# Altium project RK3568_train.PrjPcb (part 6 of 6)

## Sheet WIFI.schdoc: =
size A4; Symbol: Sheet-Symbol_A4; Company: 嘉立创EDA; Version: V1.0; Page Size: A4; @Project Name: RK3568B2地瓜派; @Page Count: 27; @Update Date: 2025-09-15; @Create Date: 2025-09-11; @Schematic Name: Schematic1; @Page No: 23; @Page Name: WIFI; Device: Sheet-Symbol_A4; Border: 1; Title Block Position: 3; Width: 1170; Height: 825; Region Start: 1; X Region Count: 6; Y Region Count: 4; Blade Width: 10; @Board Name: Board1; @Create Time: 22:26:48; @Update Time: 13:26:38; Organization: ORGANIZATION; Address1: ADDRESS 1; Address2: ADDRESS 2; Address3: ADDRESS 3; Address4: ADDRESS 4; Revision: V1.0.0; SheetNumber: 28; SheetTotal: 28
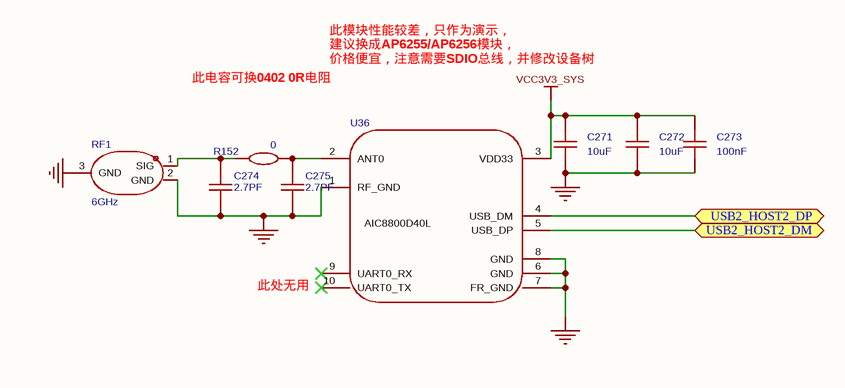
[diagram p27: WIFI.schdoc]

### Parts
C271  10uF  [C0603]
C272  10uF  [C0603]
C273  100nF  [C0603]
C274  2.7PF  [MYC0402]
C275  2.7PF  [MYC0402]
R152  0  [R0402]
RF1  6GHz  [IPEX-SMD_BWIPX-1-001E]
U36  (no value)  [BL_M8800DU6_40L]

### Ports
USB2_HOST2_DM (bidir), USB2_HOST2_DP (bidir)

### Nets
GND: C271.1 C272.1 C273.1 C274.1 C275.1 RF1.2(GND) RF1.3(GND) U36.1(RF_GND) U36.6(GND) U36.7(FR_GND) U36.8(GND)
VCC3V3_SYS: C271.2 C272.2 C273.2 U36.3(VDD33)
USB2_HOST2_DM: U36.5(USB_DP) ; port USB2_HOST2_DM
USB2_HOST2_DP: U36.4(USB_DM) ; port USB2_HOST2_DP
NetC274_2: C274.2 R152.1 RF1.1(SIG)
NetC275_2: C275.2 R152.2 U36.2(ANT0)

Not connected (* = marked no-connect by the designer): U36 9(UART0_RX)* 10(UART0_TX)*

### Notes on the sheet
- 此电容可换0402 0R电阻
- (near U36) 此模块性能较差，只作为演示，
  建议换成AP6255/AP6256模块，
  价格便宜，注意需要SDIO总线，并修改设备树
- 此处无用
- Drawn By :
- Checked By :
- Approved By :
- SheetNumber
- SheetTotal
- Revision :
- Time :
- Size :
- Date :
- A4
- DocumentName :
- Project :
- (in symbol BL_M8800DU6_40L) AIC8800D40L

### Library data of the parts
C271 C272 = CAP_0603: Symbol: Capacitance; ConvertToPcb: yes; ModelId: ac125912035d415993ca9572d50418b1聨0819f05c4eef4c71ace90d822a990e87; ModelName: C0603_L1.6-W0.8-H0.8; ModelTransform: 62.992,31.496,0,0,0,0,0,0,0; Device: CAP_0603; Value: 10uF; AddInBom: yes; Supplier Footprint: 0603; FootprintName: C0603
C273 = CAP_0603: Symbol: Capacitance; Value: 10uF; ConvertToPcb: yes; ModelId: ac125912035d415993ca9572d50418b1聨0819f05c4eef4c71ace90d822a990e87; ModelName: C0603_L1.6-W0.8-H0.8; ModelTransform: 62.992,31.496,0,0,0,0,0,0,0; Device: CAP_0603; AddInBom: yes; Supplier Footprint: 0603; FootprintName: C0603
C274 C275 = CAP_0402: Symbol: Capacitance; ConvertToPcb: yes; ModelId: 36a51122f27c49738f86b3bfa98863e0; ModelName: C0402_L1.0-W0.5-H0.5; ModelTransform: 39.37,19.685,0,0,0,0,0,0,0; Value: 2.7PF; Device: CAP_0402; AddInBom: yes; Supplier Footprint: 0402; FootprintName: MYC0402
R152 = Res_0402: as R130-R133 on sheet EMMC; Value: 0; Device: Res_0402; AddInBom: yes; Supplier Footprint: 0402; FootprintName: R0402
RF1 = BWIPX-1-001E: 连接器类型:板端;接口类型:内针;端口数量:1;接口直径:-;接口长度/高度:-;频率:6GHz;射频系列:IPEX;阻抗:50Ω;样式:-;工作温度:-;; Manufacturer: BAT WIRELESS(蝙蝠无线); AddInBom: yes; ModelId: e9910d1cc3f644ef905f39c3184653d7; ModelTransform: 122.047,118.11,0,180,0,0,29.921,0,0; Connector Type: 板端; Interface: 内针; Number of Ports: 1; RF Series: IPEX; Impedance: 50Ω; Symbol: BWIPX-1-001E; Device: BWIPX-1-001E; LCSC Part Name: IPEX 内针; SupplierPart: C496552; ManufacturerPart: BWIPX-1-001E; Supplier Footprint: SMD; JLCPCB Part Class: 扩展库; Datasheet: https://item.szlcsc.com/datasheet/BWIPX-1-001E/508501.html; Supplier: LCSC; ConvertToPcb: yes; FootprintName: IPEX-SMD_BWIPX-1-001E; ModelName: IPEX-SMD_BWIPX-1-001E; Interface Diameter: -; Interface Length/Height: -; Value: 6GHz; Style: -; Operating Temperature Range: -
U36 = BL_M8800DU6_40L: AIC8800D40L双频5G无线模块wifi6+BLE蓝牙配网IPC摄像头投屏图传; AddInBom: yes; Device: BL_M8800DU6_40L; ConvertToPcb: yes; SymbolName: BL_M8800DU6_40L; FootprintName: BL_M8800DU6_40L

## Nets that join several sheets
GND: DCDC (43 pins), RK809-5 (58 pins), SOC_PWR (226 pins), SOC_LOGIC (20 pins), SOC_CAM (C122.1 C123.1), SOC_COMPHY_USB (16 pins), SOC_DDR (11 pins), SOC_DISPLAY (11 pins), SOC_FLASH (C155.1 C156.1 GND1.1), SOC_IO (C157.1 C158.1), SOC_MAC_SAR_I2S (6 pins), SOC_SOUND (C164.1), USB (33 pins), PCIE (11 pins), RGMII (35 pins), SD (14 pins), HDMI (14 pins), LPDDR4_4X (103 pins), EMMC (22 pins), AUDIO (10 pins), KEY_LED (26 pins), CAM (7 pins), DISPLAY (21 pins), WIFI (11 pins)
LCD_1V8: DCDC (R5.1), RK809-5 (5 pins), SOC_IO (5 pins), SOC_MAC_SAR_I2S (C163.2 U7.H20), RGMII (R101.1), DISPLAY (FPC4.29)
MIPI_AVDD_0V9: RK809-5 (L13.2), SOC_CAM (C122.2 U7.W14), SOC_DISPLAY (C153.2 U7.W16)
MIPI_AVDD_1V8: RK809-5 (L15.2), SOC_CAM (C123.2 U7.Y14), SOC_DISPLAY (C154.2 U7.Y17)
TP_3V3: RK809-5 (C58.1 R20.1 U6.55), SOC_COMPHY_USB (C125.2 C128.2 U7.M23 U7.P10), SOC_IO (C158.2 R55.2 U7.V10 U7.V11), SOC_MAC_SAR_I2S (C159.2 U7.V12), RGMII (R103.1), HDMI (5 pins), EMMC (8 pins), DISPLAY (C267.2 FPC3.1)
USB_AVDD_0V9: RK809-5 (L10.2), SOC_COMPHY_USB (C127.2 C130.2 U7.P22 U7.R8)
USB_AVDD_1V8: RK809-5 (L12.2), SOC_COMPHY_USB (C126.2 C129.2 U7.P9 U7.P23)
VBUS12V: DCDC (6 pins), DISPLAY (C268.2 L20.2 U35.6)
VCC0V6_DDR: DCDC (6 pins), SOC_DDR (11 pins), LPDDR4_4X (40 pins)
VCC1V8_DDR: DCDC (R8.2), LPDDR4_4X (16 pins)
VCC3V3_PMU: DCDC (R3.2 R4.2), RK809-5 (C45.1 R30.1 U6.31), SOC_LOGIC (8 pins)
VCC3V3_SD: RK809-5 (C52.1 U6.58), SD (C203.2 C204.1 CARD1.4)
VCC3V3_SYS: DCDC (7 pins), RK809-5 (17 pins), RGMII (R106.1), KEY_LED (8 pins), CAM (L19.1), DISPLAY (L21.1), WIFI (C271.2 C272.2 C273.2 U36.3)
VCC5V0_SYS: DCDC (14 pins), RK809-5 (L11.1 R25.2 R26.2), USB (6 pins), PCIE (6 pins), HDMI (D8.2)
VCC_DDR: DCDC (R15.1), RK809-5 (5 pins), SOC_DDR (14 pins), LPDDR4_4X (44 pins)
VCCA1V8_IMAGE: RK809-5 (C50.1 C73.2 L15.1 U6.6), SOC_DISPLAY (C152.2 U7.W18)
VCCA1V8_PMU: RK809-5 (C48.1 U6.5), SOC_LOGIC (C113.2 C114.2 U7.Y21), LPDDR4_4X (R127.2)
VCCA_1V8: RK809-5 (C46.1 C66.2 L12.1 U6.3), SOC_LOGIC (C118.2 C119.2 U7.N10), SOC_COMPHY_USB (6 pins), SOC_MAC_SAR_I2S (C162.2 R64.1 U7.H22)
VCCIO_ACODEC: RK809-5 (C37.1 U6.28), SOC_SOUND (C164.2 R65.2 R66.2 U7.H17), AUDIO (R138.2)
VCCIO_FLASH: DCDC (C13.2 R5.2), SOC_FLASH (C156.2 U7.H18), EMMC (12 pins)
VCCIO_SD: RK809-5 (C44.1 U6.29), SOC_FLASH (C155.2 U7.L22)
VCCIO_WL: RK809-5 (C60.2 R18.2 R20.2 R27.1), SOC_MAC_SAR_I2S (C160.2 U7.J21)
VDD_CPU: DCDC (7 pins), SOC_PWR (15 pins)
VDD_GPU: RK809-5 (8 pins), SOC_PWR (10 pins)
VDD_LOGIC: RK809-5 (8 pins), SOC_PWR (17 pins)
VDD_NPU: RK809-5 (8 pins), SOC_PWR (9 pins)
VDDA0V9_IMAGE: RK809-5 (C30.1 C69.2 L13.1 U6.23), SOC_DISPLAY (C150.2 C151.2 U7.V17 U7.V18)
VDDA0V9_PMU: RK809-5 (C35.1 U6.20), SOC_LOGIC (6 pins)
VDDA_0V9: RK809-5 (C34.1 C64.2 L10.1 U6.21), SOC_LOGIC (C115.2 C116.2 U7.P11), SOC_COMPHY_USB (8 pins)
CAM0_CKN: SOC_CAM (U7.AH10), CAM (U34.8)
CAM0_CKP: SOC_CAM (U7.AG10), CAM (U34.9)
CAM0_DN0: SOC_CAM (U7.AH12), CAM (U34.2)
CAM0_DN1: SOC_CAM (U7.AH11), CAM (U34.5)
CAM0_DP0: SOC_CAM (U7.AG12), CAM (U34.3)
CAM0_DP1: SOC_CAM (U7.AG11), CAM (U34.7)
CAM0_GPIO: SOC_IO (U7.AA1), CAM (U34.11)
CAM_SCL: SOC_IO (R54.1 U7.V5), CAM (U34.13)
CAM_SDA: SOC_IO (R53.1 U7.V6), CAM (U34.14)
CHG_INT_L_GPIO0_C2: SOC_LOGIC (U7.AG23), KEY_LED (Q4.5)
DDR_A0_A: SOC_DDR (U7.C2), LPDDR4_4X (U21.H2)
DDR_A0_B: SOC_DDR (U7.B8), LPDDR4_4X (U21.R2)
DDR_A1_A: SOC_DDR (U7.B1), LPDDR4_4X (U21.J2)
DDR_A1_B: SOC_DDR (U7.A7), LPDDR4_4X (U21.P2)
DDR_A2_A: SOC_DDR (U7.E4), LPDDR4_4X (U21.H9)
DDR_A2_B: SOC_DDR (U7.E11), LPDDR4_4X (U21.R9)
DDR_A3_A: SOC_DDR (U7.C4), LPDDR4_4X (U21.H10)
DDR_A3_B: SOC_DDR (U7.D9), LPDDR4_4X (U21.R10)
DDR_A4_A: SOC_DDR (U7.C5), LPDDR4_4X (U21.H11)
DDR_A4_B: SOC_DDR (U7.E9), LPDDR4_4X (U21.R11)
DDR_A5_A: SOC_DDR (U7.D5), LPDDR4_4X (U21.J11)
DDR_A5_B: SOC_DDR (U7.B7), LPDDR4_4X (U21.P11)
DDR_A_CKE0: SOC_DDR (U7.B3), LPDDR4_4X (U21.J4)
DDR_A_CKE1: SOC_DDR (U7.F4), LPDDR4_4X (U21.J5)
DDR_A_CLKN: SOC_DDR (U7.A4), LPDDR4_4X (U21.J9)
DDR_A_CLKP: SOC_DDR (U7.B4), LPDDR4_4X (U21.J8)
DDR_A_CS0: SOC_DDR (U7.A2), LPDDR4_4X (U21.H4)
DDR_A_CS1: SOC_DDR (U7.B2), LPDDR4_4X (U21.H3)
DDR_A_DQS0N: SOC_DDR (U7.G2), LPDDR4_4X (U21.E3)
DDR_A_DQS0P: SOC_DDR (U7.G1), LPDDR4_4X (U21.D3)
DDR_A_DQS1N: SOC_DDR (U7.L1), LPDDR4_4X (U21.E10)
DDR_A_DQS1P: SOC_DDR (U7.L2), LPDDR4_4X (U21.D10)
DDR_A_ODTCA: SOC_DDR (U7.C1), LPDDR4_4X (U21.G2)
DDR_B_CKE0: SOC_DDR (U7.D6), LPDDR4_4X (U21.P4)
DDR_B_CKE1: SOC_DDR (U7.E6), LPDDR4_4X (U21.P5)
DDR_B_CLKN: SOC_DDR (U7.A5), LPDDR4_4X (U21.P9)
DDR_B_CLKP: SOC_DDR (U7.B6), LPDDR4_4X (U21.P8)
DDR_B_CS0: SOC_DDR (U7.D8), LPDDR4_4X (U21.R4)
DDR_B_CS1: SOC_DDR (U7.E8), LPDDR4_4X (U21.R3)
DDR_B_DQS0N: SOC_DDR (U7.B11), LPDDR4_4X (U21.V3)
DDR_B_DQS0P: SOC_DDR (U7.A11), LPDDR4_4X (U21.W3)
DDR_B_DQS1N: SOC_DDR (U7.A15), LPDDR4_4X (U21.V10)
DDR_B_DQS1P: SOC_DDR (U7.B15), LPDDR4_4X (U21.W10)
DDR_B_ODTCA: SOC_DDR (U7.A8), LPDDR4_4X (U21.T2)
DDR_DM0_A: SOC_DDR (U7.H5), LPDDR4_4X (U21.C3)
DDR_DM0_B: SOC_DDR (U7.D14), LPDDR4_4X (U21.Y3)
DDR_DM1_A: SOC_DDR (U7.J4), LPDDR4_4X (U21.C10)
DDR_DM1_B: SOC_DDR (U7.E17), LPDDR4_4X (U21.Y10)
DDR_DQ0_A: SOC_DDR (U7.F2), LPDDR4_4X (U21.B2)
DDR_DQ0_B: SOC_DDR (U7.B10), LPDDR4_4X (U21.AA2)
DDR_DQ1_A: SOC_DDR (U7.E1), LPDDR4_4X (U21.C2)
DDR_DQ1_B: SOC_DDR (U7.A9), LPDDR4_4X (U21.Y2)
DDR_DQ2_A: SOC_DDR (U7.E2), LPDDR4_4X (U21.E2)
DDR_DQ2_B: SOC_DDR (U7.D12), LPDDR4_4X (U21.V2)
DDR_DQ3_A: SOC_DDR (U7.D1), LPDDR4_4X (U21.F2)
DDR_DQ3_B: SOC_DDR (U7.E12), LPDDR4_4X (U21.U2)
DDR_DQ4_A: SOC_DDR (U7.J1), LPDDR4_4X (U21.F4)
DDR_DQ4_B: SOC_DDR (U7.A12), LPDDR4_4X (U21.U4)
DDR_DQ5_A: SOC_DDR (U7.J2), LPDDR4_4X (U21.E4)
DDR_DQ5_B: SOC_DDR (U7.D15), LPDDR4_4X (U21.V4)
DDR_DQ6_A: SOC_DDR (U7.H1), LPDDR4_4X (U21.C4)
DDR_DQ6_B: SOC_DDR (U7.E15), LPDDR4_4X (U21.Y4)
DDR_DQ7_A: SOC_DDR (U7.H4), LPDDR4_4X (U21.B4)
DDR_DQ7_B: SOC_DDR (U7.E14), LPDDR4_4X (U21.AA4)
DDR_DQ8_A: SOC_DDR (U7.M1), LPDDR4_4X (U21.B11)
DDR_DQ8_B: SOC_DDR (U7.A16), LPDDR4_4X (U21.AA11)
DDR_DQ9_A: SOC_DDR (U7.N2), LPDDR4_4X (U21.C11)
DDR_DQ9_B: SOC_DDR (U7.B17), LPDDR4_4X (U21.Y11)
DDR_DQ10_A: SOC_DDR (U7.L7), LPDDR4_4X (U21.E11)
DDR_DQ10_B: SOC_DDR (U7.A17), LPDDR4_4X (U21.V11)
DDR_DQ11_A: SOC_DDR (U7.L6), LPDDR4_4X (U21.F11)
DDR_DQ11_B: SOC_DDR (U7.B18), LPDDR4_4X (U21.U11)
DDR_DQ12_A: SOC_DDR (U7.K2), LPDDR4_4X (U21.F9)
DDR_DQ12_B: SOC_DDR (U7.B13), LPDDR4_4X (U21.U9)
DDR_DQ13_A: SOC_DDR (U7.J6), LPDDR4_4X (U21.E9)
DDR_DQ13_B: SOC_DDR (U7.A13), LPDDR4_4X (U21.V9)
DDR_DQ14_A: SOC_DDR (U7.J7), LPDDR4_4X (U21.C9)
DDR_DQ14_B: SOC_DDR (U7.D17), LPDDR4_4X (U21.Y9)
DDR_DQ15_A: SOC_DDR (U7.L4), LPDDR4_4X (U21.B9)
DDR_DQ15_B: SOC_DDR (U7.B14), LPDDR4_4X (U21.AA9)
DDR_RESET: SOC_DDR (U7.F11), LPDDR4_4X (U21.T11)
EMMC_CLKOUT/FLASH_DQS: SOC_FLASH (R51.2), EMMC (U22.M6)
EMMC_CMD/FLASH_WRN: SOC_FLASH (U7.B22), EMMC (R131.2 U22.M5)
EMMC_D0/FLASH_D0: SOC_FLASH (R50.1 U7.A24), EMMC (R130.1 U22.A3)
EMMC_D1/FLASH_D1: SOC_FLASH (U7.C21), EMMC (U22.A4)
EMMC_D2/FLASH_D2: SOC_FLASH (U7.B24), EMMC (U22.A5)
EMMC_D3/FLASH_D3: SOC_FLASH (U7.D21), EMMC (U22.B2)
EMMC_D4/FLASH_D4: SOC_FLASH (U7.A25), EMMC (U22.B3)
EMMC_D5/FLASH_D5: SOC_FLASH (U7.E21), EMMC (U22.B4)
EMMC_D6/FLASH_D6: SOC_FLASH (U7.E22), EMMC (U22.B5)
EMMC_D7/FLASH_D7: SOC_FLASH (U7.B25), EMMC (U22.B6)
EMMC_DATA_STROBE/FLASH_CLE: SOC_FLASH (U7.A26), EMMC (R132.2 U22.H5)
EMMC_RSTN/FSPI_D2/FLASH_WPN: SOC_FLASH (U7.F20), EMMC (C260.2 R133.2 U22.K5)
FLASH_VOL_SEL: DCDC (R4.1), SOC_LOGIC (U7.AG25)
GAMC1_MDIO_M0: SOC_IO (U7.AC2), PCIE (FPC1.24)
GMAC0_INT/PMEB_GPIO3_C0: SOC_IO (R55.1 U7.AD2), RGMII (U13.31)
GMAC0_MCLKINOUT: SOC_MAC_SAR_I2S (U7.F25), RGMII (C187.1 R88.1 R89.2)
GMAC0_MDC: SOC_MAC_SAR_I2S (R63.2), RGMII (U13.13)
GMAC0_MDIO: SOC_MAC_SAR_I2S (U7.H23), RGMII (R102.2 U13.14)
GMAC0_RSTN_GPIO3_B7: SOC_IO (U7.AD4), RGMII (R105.1)
GMAC0_RXCLK: SOC_MAC_SAR_I2S (U7.B28), RGMII (R111.2)
GMAC0_RXD0: SOC_MAC_SAR_I2S (U7.F27), RGMII (R107.2)
GMAC0_RXD1: SOC_MAC_SAR_I2S (U7.H25), RGMII (R108.2)
GMAC0_RXD2: SOC_MAC_SAR_I2S (U7.E27), RGMII (R109.2)
GMAC0_RXD3: SOC_MAC_SAR_I2S (U7.E28), RGMII (R110.2)
GMAC0_RXDV_CRS: SOC_MAC_SAR_I2S (U7.F24), RGMII (R112.2)
GMAC0_TXCLK: SOC_MAC_SAR_I2S (R58.2), RGMII (U13.20)
GMAC0_TXD0: SOC_MAC_SAR_I2S (R59.2), RGMII (U13.18)
GMAC0_TXD1: SOC_MAC_SAR_I2S (R60.2), RGMII (U13.17)
GMAC0_TXD2: SOC_MAC_SAR_I2S (R56.2), RGMII (U13.16)
GMAC0_TXD3: SOC_MAC_SAR_I2S (R57.2), RGMII (U13.15)
GMAC0_TXEN: SOC_MAC_SAR_I2S (R61.2 R62.1), RGMII (U13.19)
GMAC1_INT/PMEB_GPIO3_A7: SOC_IO (U7.AH2), PCIE (FPC1.21)
GMAC1_MDC_M0: SOC_IO (U7.AC3), PCIE (FPC1.23)
GMAC1_RSTN_GPIO3_B0: SOC_IO (U7.AG2), PCIE (FPC1.22)
HDMI_TX0N_PORT: SOC_DISPLAY (R46.2), HDMI (D5.2 D5.9 HDMI1.9)
HDMI_TX0P_PORT: SOC_DISPLAY (R45.2), HDMI (D5.1 D5.10 HDMI1.7)
HDMI_TX1N_PORT: SOC_DISPLAY (R44.2), HDMI (D4.5 D4.6 HDMI1.6)
HDMI_TX1P_PORT: SOC_DISPLAY (R43.2), HDMI (D4.4 D4.7 HDMI1.4)
HDMI_TX2N_PORT: SOC_DISPLAY (R42.2), HDMI (D4.2 D4.9 HDMI1.3)
HDMI_TX2P_PORT: SOC_DISPLAY (R41.2), HDMI (D4.1 D4.10 HDMI1.1)
HDMI_TX_HPDIN: SOC_DISPLAY (C149.2 U7.AB18), HDMI (R120.1)
HDMI_TXCLKN_PORT: SOC_DISPLAY (R48.2), HDMI (D5.5 D5.6 HDMI1.12)
HDMI_TXCLKP_PORT: SOC_DISPLAY (R47.2), HDMI (D5.4 D5.7 HDMI1.10)
HDMITX_CEC_M0: SOC_MAC_SAR_I2S (U7.AH6), HDMI (Q3.2 R126.1)
HDMITX_SCL: SOC_MAC_SAR_I2S (U7.AG8), HDMI (Q1.2 R122.1)
HDMITX_SDA: SOC_MAC_SAR_I2S (U7.AG7), HDMI (Q2.2 R124.1)
HP_L: RK809-5 (U6.39), AUDIO (R136.1)
HP_R: RK809-5 (U6.41), AUDIO (R137.1)
HP_SNS: RK809-5 (U6.40), AUDIO (R134.1 R135.1)
I2C0_SCL_PMIC: DCDC (U1.A3), RK809-5 (U6.1), SOC_LOGIC (R35.1 U7.AF24)
I2C0_SDA_PMIC: DCDC (U1.B1), RK809-5 (U6.2), SOC_LOGIC (R36.1 U7.AB21)
I2C1_SCL_TP: SOC_LOGIC (R37.1 U7.AG24), DISPLAY (FPC3.3)
I2C1_SDA_TP: SOC_LOGIC (R38.1 U7.AB20), DISPLAY (FPC3.2)
I2C3_SCL_M0: SOC_SOUND (R66.1 U7.E18), KEY_LED (FPC2.4)
I2C3_SDA_M0: SOC_SOUND (R65.1 U7.D18), KEY_LED (FPC2.3)
I2S1_LRCK_TX_M0_RK809: RK809-5 (U6.14), SOC_SOUND (U7.A20)
I2S1_MCLK_M0_RK809: RK809-5 (U6.16), SOC_SOUND (U7.A19)
I2S1_SCLK_TX_M0_RK809: RK809-5 (U6.15), SOC_SOUND (U7.B19)
I2S1_SDI0_M0/PDM_SDI0_M0_RK809: RK809-5 (U6.18), SOC_SOUND (U7.B21)
I2S1_SDO0_M0_RK809: RK809-5 (U6.17), SOC_SOUND (U7.B20)
LCD0_BL_PWM4: SOC_LOGIC (U7.AE23), DISPLAY (R151.2 U35.4)
LCD_CKN: SOC_DISPLAY (U7.AG15), DISPLAY (FPC4.18)
LCD_CKP: SOC_DISPLAY (U7.AH15), DISPLAY (FPC4.17)
LCD_D0N: SOC_DISPLAY (U7.AG17), DISPLAY (FPC4.21)
LCD_D0P: SOC_DISPLAY (U7.AH17), DISPLAY (FPC4.20)
LCD_D1N: SOC_DISPLAY (U7.AG16), DISPLAY (FPC4.15)
LCD_D1P: SOC_DISPLAY (U7.AH16), DISPLAY (FPC4.14)
LCD_D2N: SOC_DISPLAY (U7.AG14), DISPLAY (FPC4.12)
LCD_D2P: SOC_DISPLAY (U7.AH14), DISPLAY (FPC4.11)
LCD_D3N: SOC_DISPLAY (U7.AG13), DISPLAY (FPC4.24)
LCD_D3P: SOC_DISPLAY (U7.AH13), DISPLAY (FPC4.23)
LCD_RST: SOC_IO (U7.AA6), DISPLAY (FPC4.27)
MIC1_INN: RK809-5 (C84.2), AUDIO (C262.1 MIC1.2 R140.2)
MIC1_INP: RK809-5 (C79.2), AUDIO (C262.2 MIC1.1 R139.1)
PCIE20_CLKREQN_M1: SOC_IO (U7.AG6), PCIE (FPC1.9)
PCIE20_PERSTN_M1: SOC_IO (U7.AD1), PCIE (FPC1.8)
PCIE20_REFCLKN: SOC_COMPHY_USB (U7.V25), PCIE (C178.1)
PCIE20_REFCLKP: SOC_COMPHY_USB (U7.V24), PCIE (C177.1)
PCIE20_RXN: SOC_COMPHY_USB (U7.Y28), PCIE (C181.1)
PCIE20_RXP: SOC_COMPHY_USB (U7.Y27), PCIE (C182.1)
PCIE20_TXN: SOC_COMPHY_USB (U7.W28), PCIE (C179.1)
PCIE20_TXP: SOC_COMPHY_USB (U7.W27), PCIE (C180.1)
PCIE20_WAKEN_M1: SOC_IO (U7.AD7), PCIE (FPC1.10)
PDM_CLK0_M0_RK809: RK809-5 (U6.19), SOC_SOUND (U7.C20)
PMIC_INT_L: RK809-5 (U6.7), SOC_LOGIC (U7.AA22)
PMIC_PWRON: RK809-5 (C83.1 U6.52), KEY_LED (R144.1)
PMIC_RESET_KEY: RK809-5 (R31.1), KEY_LED (R141.1)
PMIC_SLEEP_H: DCDC (U1.A1), RK809-5 (U6.49), SOC_LOGIC (U7.AG28)
RESETn: RK809-5 (C85.2 R30.2 R31.2 U6.67), SOC_LOGIC (C108.2 R33.2 U7.AH27)
SARADC_VIN0_KEY/RECOVERY: SOC_MAC_SAR_I2S (C161.1 R64.2 U7.B27), KEY_LED (R145.1)
SDMMC0_CLK: SOC_FLASH (R52.2), SD (R116.1)
SDMMC0_CMD: SOC_FLASH (U7.H27), SD (R115.1)
SDMMC0_D0: SOC_FLASH (U7.J25), SD (R117.1)
SDMMC0_D1: SOC_FLASH (U7.J24), SD (R118.1)
SDMMC0_D2: SOC_FLASH (U7.H26), SD (R113.1)
SDMMC0_D3: SOC_FLASH (U7.J23), SD (R114.1)
SDMMC0_DET: SOC_LOGIC (U7.Y22), SD (R119.1)
SPKN_OUT: RK809-5 (C78.2 L14.2), AUDIO (U23.1 U25.2)
SPKP_OUT: RK809-5 (C77.2 L16.2), AUDIO (U23.2 U24.2)
TP_INT: SOC_LOGIC (U7.AC22), DISPLAY (FPC3.4)
TP_RST: SOC_LOGIC (U7.AA20), DISPLAY (FPC3.5)
UART2_RX_M0_DEBUG: SOC_LOGIC (U7.AC20), KEY_LED (R142.2)
UART2_TX_M0_DEBUG: SOC_LOGIC (U7.AH24), KEY_LED (R143.2)
USB2_HOST2_DM: SOC_COMPHY_USB (U7.R1), WIFI (U36.5)
USB2_HOST2_DP: SOC_COMPHY_USB (U7.R2), WIFI (U36.4)
USB3_HOST1_DM: SOC_COMPHY_USB (U7.P25), USB (USB1.2)
USB3_HOST1_DP: SOC_COMPHY_USB (U7.P24), USB (USB1.3)
USB3_HOST1_SSRXN: SOC_COMPHY_USB (U7.U27), USB (R70.1)
USB3_HOST1_SSRXP: SOC_COMPHY_USB (U7.U28), USB (R71.1)
USB3_HOST1_SSTXN: SOC_COMPHY_USB (U7.V27), USB (C169.1)
USB3_HOST1_SSTXP: SOC_COMPHY_USB (U7.V28), USB (C170.1)
USB3_OTG0_DM: SOC_COMPHY_USB (U7.P28), USB (R78.1)
USB3_OTG0_DP: SOC_COMPHY_USB (U7.P27), USB (R76.1)
USB3_OTG0_VBUSDET: SOC_COMPHY_USB (C124.2 U7.M24), USB (C174.1 R79.1 R80.2)
USB5V0_EN_H_GPIO0_D6: SOC_LOGIC (U7.AC24), USB (R74.2 U10.4)
USB_HOST_PWREN_H_GPIO0_A6: SOC_LOGIC (U7.AE24), USB (R69.2 U9.4)
VDD_CPU_COM: DCDC (C3.1 R1.1 U1.A4), SOC_PWR (U7.M15)
WIFI_PWREN_GPIO0_A0: SOC_LOGIC (U7.AG27), KEY_LED (Q4.2)